# Altium project Pathfinder_pcb.PrjPcb
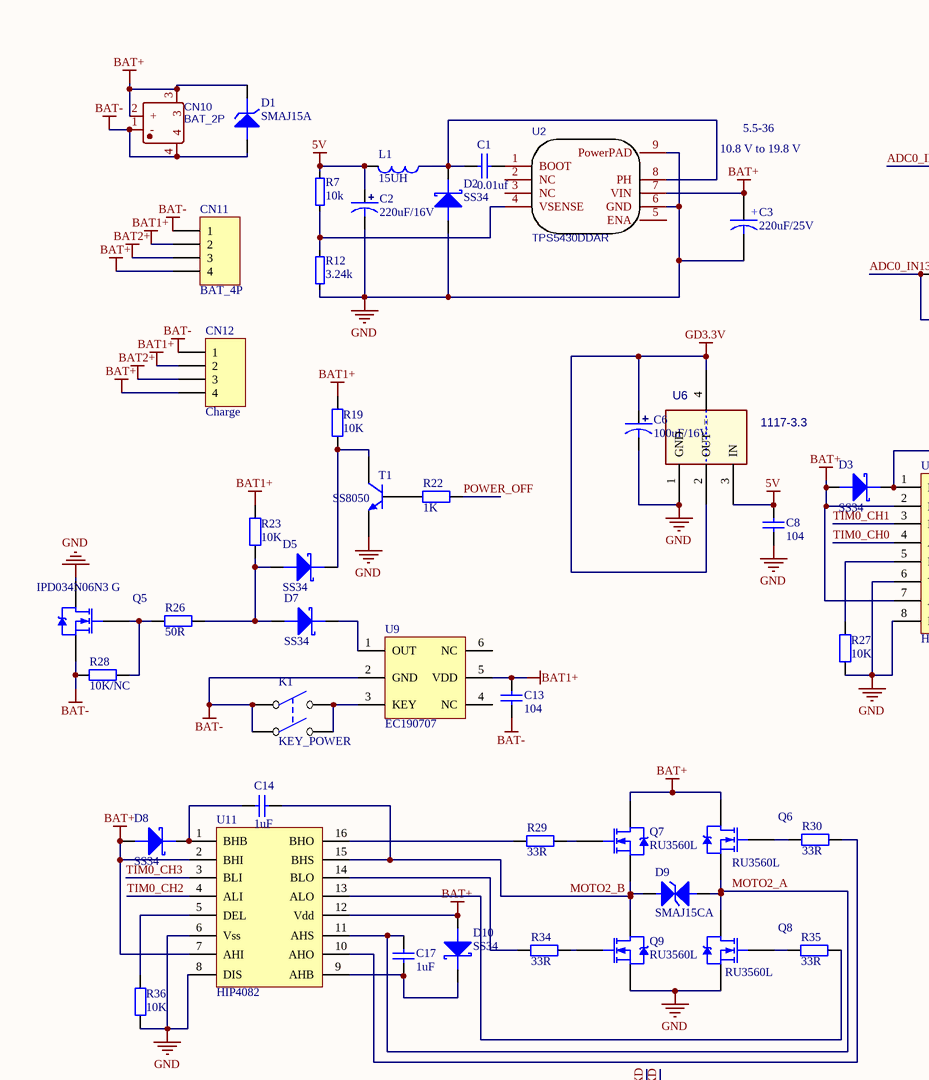
[diagram p0: pathfinder_sch.SchDoc, top left]
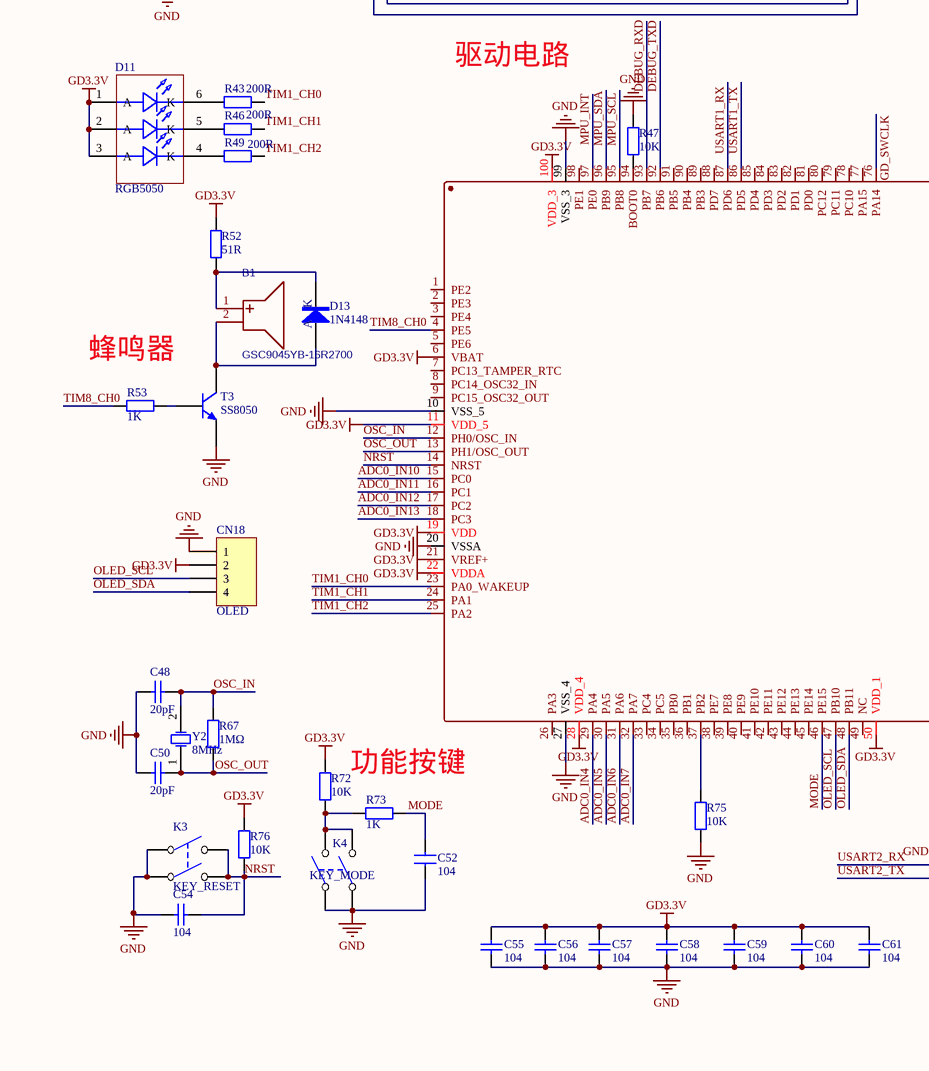
[diagram p1: pathfinder_sch.SchDoc, bottom left]
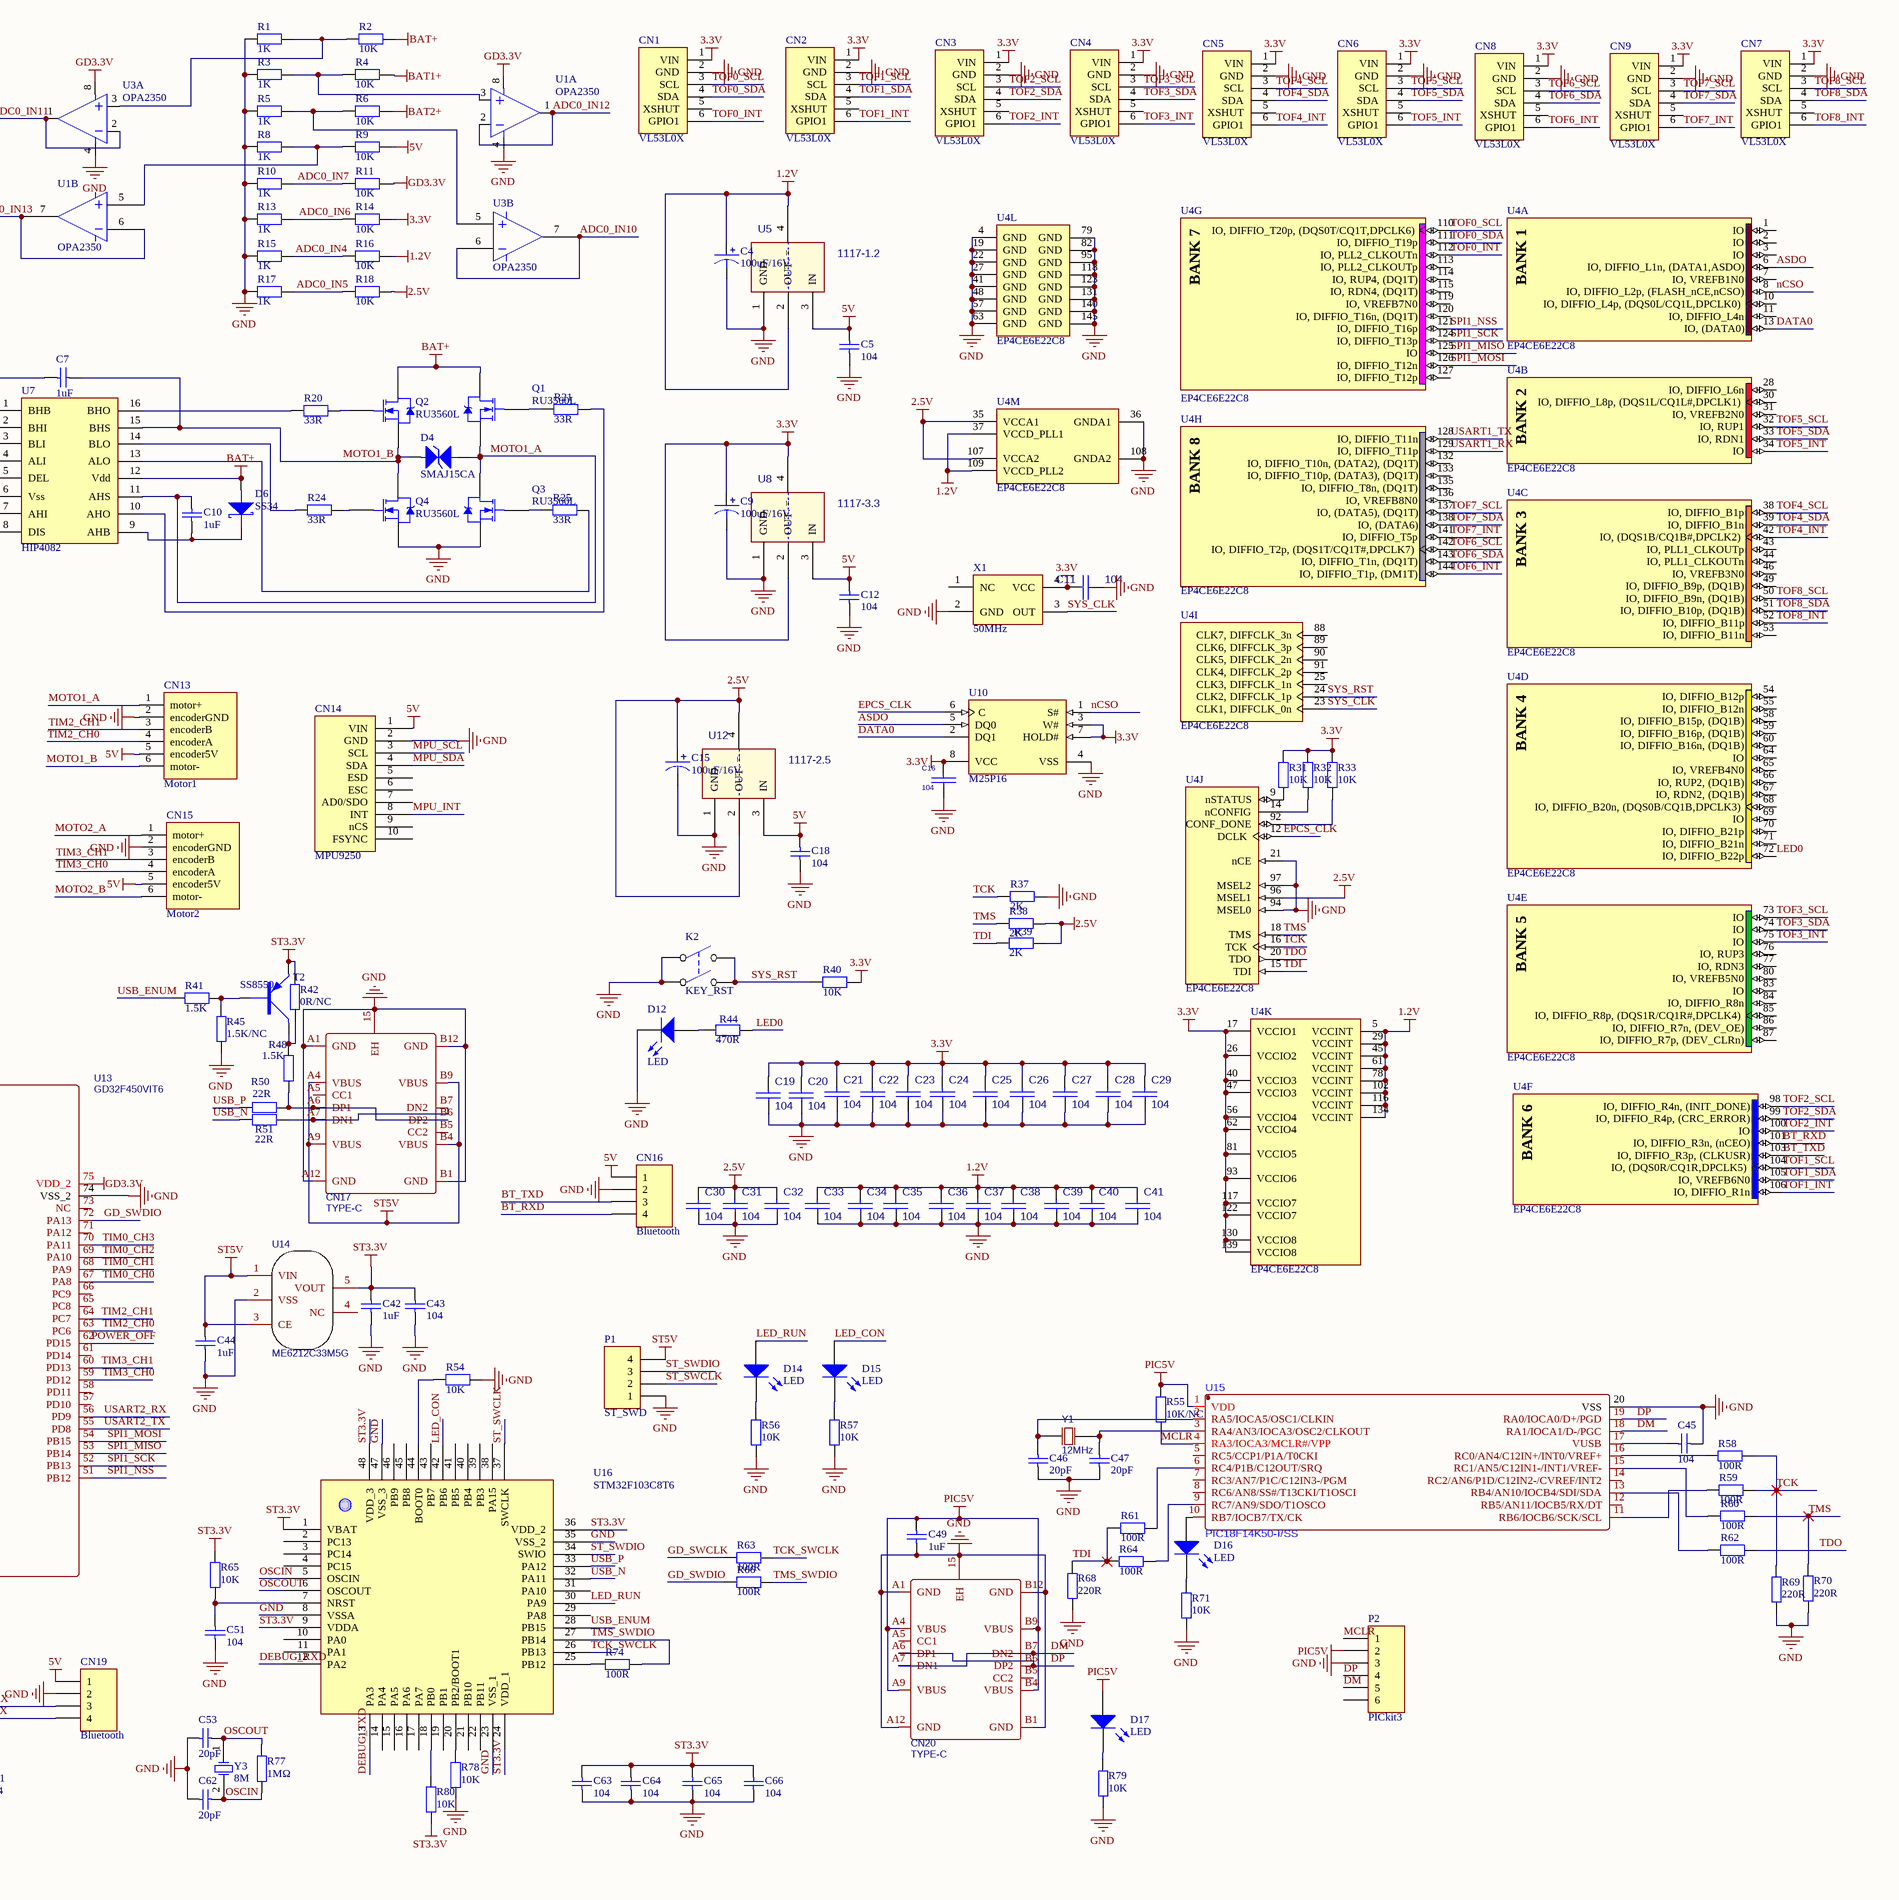
[diagram p2: pathfinder_sch.SchDoc, bottom right]
1 sheet, 223 parts. Net scope: global (net labels, ports and power ports of the same name join across sheets).
Board file: pathfinder_pcb.PcbDoc

## Sheet pathfinder_sch.SchDoc
size A2

### Parts
B1  GSC9045YB-16R2700  [BUZ-SMD_GSC9045YB-16R2700]
C1  0.01uf  [0603-JLC]
C2  220uF/16V  [SMD,6.3x5.3mm]
C3  220uF/25V  [SMD,6.3x5.8mm]
C4  100uF/16V  [SMD,6.3x5.3mm]
C5  104  [0603-JLC]
C6  100uF/16V  [SMD,6.3x5.3mm]
C7  1uF  [0603-JLC]
C8  104  [0603-JLC]
C9  100uF/16V  [SMD,6.3x5.3mm]
C10  1uF  [0603-JLC]
C11  104  [0603-JLC]
C12  104  [0603-JLC]
C13  104  [0603-JLC]
C14  1uF  [0603-JLC]
C15  100uF/16V  [SMD,6.3x5.3mm]
C16  104  [0603-JLC]
C17  1uF  [0603-JLC]
C18  104  [0603-JLC]
C19  104  [0603-JLC]
C20  104  [0603-JLC]
C21  104  [0603-JLC]
C22  104  [0603-JLC]
C23  104  [0603-JLC]
C24  104  [0603-JLC]
C25  104  [0603-JLC]
C26  104  [0603-JLC]
C27  104  [0603-JLC]
C28  104  [0603-JLC]
C29  104  [0603-JLC]
C30  104  [0603-JLC]
C31  104  [0603-JLC]
C32  104  [0603-JLC]
C33  104  [0603-JLC]
C34  104  [0603-JLC]
C35  104  [0603-JLC]
C36  104  [0603-JLC]
C37  104  [0603-JLC]
C38  104  [0603-JLC]
C39  104  [0603-JLC]
C40  104  [0603-JLC]
C41  104  [0603-JLC]
C42  1uF  [0603-JLC]
C43  104  [0603-JLC]
C44  1uF  [0603-JLC]
C45  104  [0603-JLC]
C46  20pF  [0603-JLC]
C47  20pF  [0603-JLC]
C48  20pF  [0603-JLC]
C49  1uF  [0603-JLC]
C50  20pF  [0603-JLC]
C51  104  [0603-JLC]
C52  104  [0603-JLC]
C53  20pF  [0603-JLC]
C54  104  [0603-JLC]
C55  104  [0603-JLC]
C56  104  [0603-JLC]
C57  104  [0603-JLC]
C58  104  [0603-JLC]
C59  104  [0603-JLC]
C60  104  [0603-JLC]
C61  104  [0603-JLC]
C62  20pF  [0603-JLC]
C63  104  [0603-JLC]
C64  104  [0603-JLC]
C65  104  [0603-JLC]
C66  104  [0603-JLC]
CN1  VL53L0X  [HDR1X6]
CN2  VL53L0X  [HDR1X6]
CN3  VL53L0X  [HDR1X6]
CN4  VL53L0X  [HDR1X6]
CN5  VL53L0X  [HDR1X6]
CN6  VL53L0X  [HDR1X6]
CN7  VL53L0X  [HDR1X6]
CN8  VL53L0X  [HDR1X6]
CN9  VL53L0X  [HDR1X6]
CN10  BAT_2P  [CONN-TH_XT60PW-M]
CN11  BAT_4P  [CONN-TH_4P-P2.54_X8821WR-06S-N2SN]
CN12  Charge  [CONN-TH_4P-P2.54_X8821WR-06S-N2SN]
CN13  Motor1  [CONN-TH_6P-P2.50_X8821WR-06S-N2SN]
CN14  MPU9250  [HDR1X10]
CN15  Motor2  [CONN-TH_6P-P2.50_X8821WR-06S-N2SN]
CN16  Bluetooth  [HDR1X4]
CN17  TYPE-C  [TYPE-C-SMD_918-468K2029Y50001]
CN18  OLED  [HDR1X4]
CN19  Bluetooth  [HDR1X4]
CN20  TYPE-C  [TYPE-C-SMD_918-468K2029Y50001]
D1  SMAJ15A  [SMA(DO-214AC)]
D2  SS34  [SMA(DO-214AC)]
D3  SS34  [SMA(DO-214AC)]
D4  SMAJ15CA  [SMA(DO-214AC)]
D5  SS34  [SMA(DO-214AC)]
D6  SS34  [SMA(DO-214AC)]
D7  SS34  [SMA(DO-214AC)]
D8  SS34  [SMA(DO-214AC)]
D9  SMAJ15CA  [SMA(DO-214AC)]
D10  SS34  [SMA(DO-214AC)]
D11  RGB5050  [LED-SMD_6P-L5.0-W5.0-FD]
D12  LED  [0603LED]
D13  1N4148  [1206]
D14  LED  [0603LED]
D15  LED  [0603LED]
D16  LED  [0603LED]
D17  LED  [0603LED]
K1  KEY_POWER  [SW-6/6]
K2  KEY_RST  [SW-6/6]
K3  KEY_RESET  [SW-6/6]
K4  KEY_MODE  [SW-6/6]
L1  15UH  [IND-SMD_L7.1-W6.6]
P1  ST_SWD  [HDR1X4]
P2  PICkit3  [HDR1X6]
Q1  RU3560L  [TO-252-3L]
Q2  RU3560L  [TO-252-3L]
Q3  RU3560L  [TO-252-3L]
Q4  RU3560L  [TO-252-3L]
Q5  IPD034N06N3 G  [TO-252-3_L6.5-W5.8-P4.58-TL]
Q6  RU3560L  [TO-252-3L]
Q7  RU3560L  [TO-252-3L]
Q8  RU3560L  [TO-252-3L]
Q9  RU3560L  [TO-252-3L]
R1  1K  [0603-JLC]
R2  10K  [0603-JLC]
R3  1K  [0603-JLC]
R4  10K  [0603-JLC]
R5  1K  [0603-JLC]
R6  10K  [0603-JLC]
R7  10k  [0603-JLC]
R8  1K  [0603-JLC]
R9  10K  [0603-JLC]
R10  1K  [0603-JLC]
R11  10K  [0603-JLC]
R12  3.24k  [0603-JLC]
R13  1K  [0603-JLC]
R14  10K  [0603-JLC]
R15  1K  [0603-JLC]
R16  10K  [0603-JLC]
R17  1K  [0603-JLC]
R18  10K  [0603-JLC]
R19  10K  [0603-JLC]
R20  33R  [0603-JLC]
R21  33R  [0603-JLC]
R22  1K  [0603-JLC]
R23  10K  [0603-JLC]
R24  33R  [0603-JLC]
R25  33R  [0603-JLC]
R26  50R  [0603-JLC]
R27  10K  [0603-JLC]
R28  10K/NC  [0603-JLC]
R29  33R  [0603-JLC]
R30  33R  [0603-JLC]
R31  10K  [0603-JLC]
R32  10K  [0603-JLC]
R33  10K  [0603-JLC]
R34  33R  [0603-JLC]
R35  33R  [0603-JLC]
R36  10K  [0603-JLC]
R37  2K  [0603-JLC]
R38  2K  [0603-JLC]
R39  2K  [0603-JLC]
R40  10K  [0603-JLC]
R41  1.5K  [0603-JLC]
R42  0R/NC  [0603-JLC]
R43  200R  [0603-JLC]
R44  470R  [0603-JLC]
R45  1.5K/NC  [0603-JLC]
R46  200R  [0603-JLC]
R47  10K  [0603-JLC]
R48  1.5K  [0603-JLC]
R49  200R  [0603-JLC]
R50  22R  [0603-JLC]
R51  22R  [0603-JLC]
R52  51R  [0603-JLC]
R53  1K  [0603-JLC]
R54  10K  [0603-JLC]
R55  10K/NC  [0603-JLC]
R56  10K  [0603-JLC]
R57  10K  [0603-JLC]
R58  100R  [0603-JLC]
R59  100R  [0603-JLC]
R60  100R  [0603-JLC]
R61  100R  [0603-JLC]
R62  100R  [0603-JLC]
R63  100R  [0603-JLC]
R64  100R  [0603-JLC]
R65  10K  [0603-JLC]
R66  100R  [0603-JLC]
R67  1MΩ  [0603-JLC]
R68  220R  [0603-JLC]
R69  220R  [0603-JLC]
R70  220R  [0603-JLC]
R71  10K  [0603-JLC]
R72  10K  [0603-JLC]
R73  1K  [0603-JLC]
R74  100R  [0603-JLC]
R75  10K  [0603-JLC]
R76  10K  [0603-JLC]
R77  1MΩ  [0603-JLC]
R78  10K  [0603-JLC]
R79  10K  [0603-JLC]
R80  10K  [0603-JLC]
T1  SS8050  [SOT-23]
T2  SS8550  [SOT-23]
T3  SS8050  [SOT-23]
U1  OPA2350  [SOP_8]  (parts A,B of 2)
U2  TPS5430DDAR  [SOIC-8_L5.0-W4.0-P1.27-LS6.0-BL-EP2.0]
U3  OPA2350  [SOP_8]  (parts A,B of 2)
U4  EP4CE6E22C8  [EQFP144_L]  (parts A,B,C,D,E,F,G,H,I,J,K,L,M of 13)
U5  1117-1.2  [SOT223]
U6  1117-3.3  [SOT223]
U7  HIP4082  [HIP4082b]
U8  1117-3.3  [SOT223]
U9  EC190707  [SOT-23-6_L2.9-W1.6-P0.95-LS2.8-BL]
U10  M25P16  [SOIC-8_150mil]
U11  HIP4082  [HIP4082b]
U12  1117-2.5  [SOT223]
U13  GD32F450VIT6  [LQFP-100_L14.0-W14.0-P0.50-LS16.0-BL]
U14  ME6212C33M5G  [ME6212C33M5G]
U15  PIC18F14K50-I/SS  [SSOP-20_L7.2-W5.3-P0.65-LS7.8-BL]
U16  STM32F103C8T6  [STM32F103C6T6]
X1  50MHz  [SMD-7050_4P]
Y1  12MHz  [HC-49S_L11.4-W4.8]
Y2  8MHz  [3225]
Y3  8M  [3225]

### Nets
1.2V: C4.1 C33.1 C34.1 C35.1 C36.1 C37.1 C38.1 C39.1 C40.1 C41.1 R16.2 U4.5(VCCINT) U4.29(VCCINT) U4.37(VCCD_PLL1) U4.45(VCCINT) U4.61(VCCINT) U4.78(VCCINT) U4.102(VCCINT) U4.109(VCCD_PLL2) U4.116(VCCINT) U4.134(VCCINT) U5.2(OUT) U5.4(=)
2.5V: C15.1 C30.1 C31.1 C32.1 R18.2 R38.1 R39.1 U4.35(VCCA1) U4.96(MSEL1) U4.107(VCCA2) U12.2(OUT) U12.4(=)
3.3V: C9.1 C11.1 C16.1 C19.1 C20.1 C21.1 C22.1 C23.1 C24.1 C25.1 C26.1 C27.1 C28.1 C29.1 CN1.1(VIN) CN2.1(VIN) CN3.1(VIN) CN4.1(VIN) CN5.1(VIN) CN6.1(VIN) CN7.1(VIN) CN8.1(VIN) CN9.1(VIN) R14.2 R31.2 R32.2 R33.2 R40.1 U4.17(VCCIO1) U4.26(VCCIO2) U4.40(VCCIO3) U4.47(VCCIO3) U4.56(VCCIO4) U4.62(VCCIO4) U4.81(VCCIO5) U4.93(VCCIO6) U4.117(VCCIO7) U4.122(VCCIO7) U4.130(VCCIO8) U4.139(VCCIO8) U8.2(OUT) U8.4(=) U10.3(W#) U10.7(HOLD#) U10.8(VCC) X1.4(VCC)
5V: C2.1 C5.2 C8.2 C12.2 C18.2 CN13.5(encoder5V) CN14.1(VIN) CN15.5(encoder5V) CN16.1 CN19.1 L1.1 R7.2 R9.2 U5.3(IN) U6.3(IN) U8.3(IN) U12.3(IN)
BAT1+: C13.2 CN11.2 CN12.2 R4.2 R19.1 R23.2 U9.5(VDD)
BAT2+: CN11.3 CN12.3 R6.2
BAT+: C3.1 CN10.2(+) CN10.3 CN11.4 CN12.4 D1.1(K) D3.2(A) D6.2(A) D8.2(A) D10.2(A) Q1.2(D) Q2.2(D) Q6.2(D) Q7.2(D) R2.2 U2.7(VIN) U7.2(BHI) U7.7(AHI) U7.12(Vdd) U11.2(BHI) U11.7(AHI) U11.12(Vdd)
BAT-: C13.1 CN10.1(-) CN10.4 CN11.1 CN12.1 D1.2(A) K1.1(COMMON1) Q5.3(S) R28.2 U9.2(GND)
GD3.3V: C6.1 C55.2 C56.2 C57.2 C58.2 C59.2 C60.2 C61.2 CN18.2 D11.1(A) D11.2(A) D11.3(A) R11.2 R52.1 R72.2 R76.2 U1.8 U3.8 U6.2(OUT) U6.4(=) U13.6(VBAT) U13.11(VDD_5) U13.19(VDD) U13.21(VREF+) U13.22(VDDA) U13.28(VDD_4) U13.50(VDD_1) U13.75(VDD_2) U13.100(VDD_3)
GND: C2.2 C3.2 C4.2 C5.1 C6.2 C8.1 C9.2 C11.2 C12.1 C15.2 C16.2 C18.1 C19.2 C20.2 C21.2 C22.2 C23.2 C24.2 C25.2 C26.2 C27.2 C28.2 C29.2 C30.2 C31.2 C32.2 C33.2 C34.2 C35.2 C36.2 C37.2 C38.2 C39.2 C40.2 C41.2 C42.1 C43.1 C44.1 C45.1 C46.1 C47.1 C48.1 C49.1 C50.1 C51.2 C52.2 C53.1 C54.1 C55.1 C56.1 C57.1 C58.1 C59.1 C60.1 C61.1 C62.1 C63.1 C64.1 C65.1 C66.1 CN1.2(GND) CN2.2(GND) CN3.2(GND) CN4.2(GND) CN5.2(GND) CN6.2(GND) CN7.2(GND) CN8.2(GND) CN9.2(GND) CN13.2(encoderGND) CN14.2(GND) CN15.2(encoderGND) CN16.2 CN17.15(EH) CN17.A1(GND) CN17.A12(GND) CN17.B1(GND) CN17.B12(GND) CN18.1 CN19.2 CN20.15(EH) CN20.A1(GND) CN20.A12(GND) CN20.B1(GND) CN20.B12(GND) D2.2(A) D12.2(K) K2.1(COMMON1) K3.1(COMMON1) K4.1(COMMON1) P1.1 P2.3 Q3.3(S) Q4.3(S) Q5.2(D) Q8.3(S) Q9.3(S) R1.1 R3.1 R5.1 R8.1 R10.1 R12.1 R13.1 R15.1 R17.1 R27.1 R36.1 R37.1 R45.2 R47.1 R54.2 R56.1 R57.1 R68.1 R69.1 R70.1 R71.1 R75.2 R78.1 R79.1 T1.2(E) T3.2(E) U1.4 U2.6(GND) U2.9(PowerPAD) U3.4 U4.4(GND) U4.19(GND) U4.21(nCE) U4.22(GND) U4.27(GND) U4.36(GNDA1) U4.41(GND) U4.48(GND) U4.57(GND) U4.63(GND) U4.79(GND) U4.82(GND) U4.94(MSEL0) U4.95(GND) U4.97(MSEL2) U4.108(GNDA2) U4.118(GND) U4.123(GND) U4.131(GND) U4.140(GND) U4.145(GND) U5.1(GND) U6.1(GND) U7.6(Vss) U7.8(DIS) U8.1(GND) U10.4(VSS) U11.6(Vss) U11.8(DIS) U12.1(GND) U13.10(VSS_5) U13.20(VSSA) U13.27(VSS_4) U13.74(VSS_2) U13.99(VSS_3) U14.2(VSS) U15.20(VSS) U16.8(VSSA) U16.23(VSS_1) U16.35(VSS_2) U16.47(VSS_3) X1.2(GND)
PIC5V: C49.2 CN20.A4(VBUS) CN20.A9(VBUS) CN20.B4(VBUS) CN20.B9(VBUS) D17.1(A) P2.2 R55.2 U15.1(VDD)
ST3.3V: C42.2 C43.2 C63.2 C64.2 C65.2 C66.2 R42.1 R65.2 R80.1 T2.2(E) U14.5(VOUT) U16.1(VBAT) U16.9(VDDA) U16.24(VDD_1) U16.36(VDD_2) U16.48(VDD_3)
ST5V: C44.2 CN17.A4(VBUS) CN17.A9(VBUS) CN17.B4(VBUS) CN17.B9(VBUS) P1.4 U14.1(VIN) U14.3(CE)
ADC0_IN4: R15.2 R16.1 U13.29(PA4)
ADC0_IN5: R17.2 R18.1 U13.30(PA5)
ADC0_IN6: R13.2 R14.1 U13.31(PA6)
ADC0_IN7: R10.2 R11.1 U13.32(PA7)
ADC0_IN10: U3.6 U3.7 U13.15(PC0)
ADC0_IN11: U3.1 U3.2 U13.16(PC1)
ADC0_IN12: U1.1 U1.2 U13.17(PC2)
ADC0_IN13: U1.6 U1.7 U13.18(PC3)
ASDO: U4.6(IO,_DIFFIO_L1n,_(DATA1,ASDO)) U10.5(DQ0)
BT_RXD: CN16.4 U4.101(IO,_DIFFIO_R3n,_(nCEO))
BT_TXD: CN16.3 U4.103(IO,_DIFFIO_R3p,_(CLKUSR))
DATA0: U4.13(IO,_(DATA0)) U10.2(DQ1)
DEBUG_RXD: U13.93(PB7) U16.12(PA2)
DEBUG_TXD: U13.92(PB6) U16.13(PA3)
DM: CN20.A7(DN1) CN20.B7(DN2) P2.5 U15.18(RA1/IOCA1/D-/PGC)
DP: CN20.A6(DP1) CN20.B6(DP2) P2.4 U15.19(RA0/IOCA0/D+/PGD)
EPCS_CLK: U4.12(DCLK) U10.6(C)
GD_SWCLK: R63.1 U13.76(PA14)
GD_SWDIO: R66.1 U13.72(PA13)
LED0: R44.1 U4.72(IO,_DIFFIO_B22p)
LED_CON: D15.1(A) U16.42(PB6)
LED_RUN: D14.1(A) U16.30(PA9)
MCLR: P2.1 R55.1 U15.4(RA3/IOCA3/MCLR#/VPP)
MODE: C52.1 R73.1 U13.46(PE15)
MOTO1_A: C10.2 CN13.1(motor+) D4.2(K) Q1.3(S) Q3.2(D) U7.11(AHS)
MOTO1_B: C7.2 CN13.6(motor-) D4.1(A) Q2.3(S) Q4.2(D) U7.15(BHS)
MOTO2_A: C17.2 CN15.1(motor+) D9.2(K) Q6.3(S) Q8.2(D) U11.11(AHS)
MOTO2_B: C14.2 CN15.6(motor-) D9.1(A) Q7.3(S) Q9.2(D) U11.15(BHS)
MPU_INT: CN14.8(INT) U13.97(PE0)
MPU_SCL: CN14.3(SCL) U13.95(PB8)
MPU_SDA: CN14.4(SDA) U13.96(PB9)
nCSO: U4.8(IO,_DIFFIO_L2p,_(FLASH_nCE,nCSO)) U10.1(S#)
NRST: C54.2 K3.2(NO1) R76.1 U13.14(NRST)
OLED_SCL: CN18.3 U13.47(PB10)
OLED_SDA: CN18.4 U13.48(PB11)
OSC_IN: C48.2 R67.2 U13.12(PH0/OSC_IN) Y2.2(OSC2)
OSC_OUT: C50.2 R67.1 U13.13(PH1/OSC_OUT) Y2.1(OSC1)
OSCIN: C62.2 R77.1 U16.5(OSCIN) Y3.2
OSCOUT: C53.2 R77.2 U16.6(OSCOUT) Y3.1
POWER_OFF: R22.1 U13.62(PD15)
SPI1_MISO: U4.125(IO) U13.53(PB14)
SPI1_MOSI: U4.126(IO,_DIFFIO_T12n) U13.54(PB15)
SPI1_NSS: U4.121(IO,_DIFFIO_T16p) U13.51(PB12)
SPI1_SCK: U4.124(IO,_DIFFIO_T13p) U13.52(PB13)
ST_SWCLK: P1.2 U16.37(SWCLK)
ST_SWDIO: P1.3 U16.34(SWIO)
SYS_CLK: U4.23(CLK1,_DIFFCLK_0n) X1.3(OUT)
SYS_RST: K2.2(NO1) R40.2 U4.24(CLK2,_DIFFCLK_1p)
TCK: R37.2 R58.1 R59.1 R69.2 U4.16(TCK)
TCK_SWCLK: R63.2 U16.26(PB13)
TDI: R39.2 R61.2 R64.2 R68.2 U4.15(TDI)
TDO: R62.1 U4.20(TDO)
TIM0_CH0: U7.4(ALI) U13.67(PA8)
TIM0_CH1: U7.3(BLI) U13.68(PA9)
TIM0_CH2: U11.4(ALI) U13.69(PA10)
TIM0_CH3: U11.3(BLI) U13.70(PA11)
TIM1_CH0: R43.1 U13.23(PA0_WAKEUP)
TIM1_CH1: R46.1 U13.24(PA1)
TIM1_CH2: R49.1 U13.25(PA2)
TIM2_CH0: CN13.4(encoderA) U13.63(PC6)
TIM2_CH1: CN13.3(encoderB) U13.64(PC7)
TIM3_CH0: CN15.4(encoderA) U13.59(PD12)
TIM3_CH1: CN15.3(encoderB) U13.60(PD13)
TIM8_CH0: R53.1 U13.4(PE5)
TMS: R38.2 R60.1 R70.2 U4.18(TMS)
TMS_SWDIO: R66.2 R74.2 U16.27(PB14)
TOF0_INT: CN1.6(GPIO1) U4.112(IO,_PLL2_CLKOUTn)
TOF0_SCL: CN1.3(SCL) U4.110(IO,_DIFFIO_T20p,_(DQS0T/CQ1T,DPCLK6))
TOF0_SDA: CN1.4(SDA) U4.111(IO,_DIFFIO_T19p)
TOF1_INT: CN2.6(GPIO1) U4.106(IO,_DIFFIO_R1n)
TOF1_SCL: CN2.3(SCL) U4.104(IO,_(DQS0R/CQ1R,DPCLK5))
TOF1_SDA: CN2.4(SDA) U4.105(IO,_VREFB6N0)
TOF2_INT: CN3.6(GPIO1) U4.100(IO)
TOF2_SCL: CN3.3(SCL) U4.98(IO,_DIFFIO_R4n,_(INIT_DONE))
TOF2_SDA: CN3.4(SDA) U4.99(IO,_DIFFIO_R4p,_(CRC_ERROR))
TOF3_INT: CN4.6(GPIO1) U4.75(IO)
TOF3_SCL: CN4.3(SCL) U4.73(IO)
TOF3_SDA: CN4.4(SDA) U4.74(IO)
TOF4_INT: CN5.6(GPIO1) U4.42(IO,_(DQS1B/CQ1B#,DPCLK2))
TOF4_SCL: CN5.3(SCL) U4.38(IO,_DIFFIO_B1p)
TOF4_SDA: CN5.4(SDA) U4.39(IO,_DIFFIO_B1n)
TOF5_INT: CN6.6(GPIO1) U4.34(IO)
TOF5_SCL: CN6.3(SCL) U4.32(IO,_RUP1)
TOF5_SDA: CN6.4(SDA) U4.33(IO,_RDN1)
TOF6_INT: CN8.6(GPIO1) U4.144(IO,_DIFFIO_T1p,_(DM1T))
TOF6_SCL: CN8.3(SCL) U4.142(IO,_DIFFIO_T2p,_(DQS1T/CQ1T#,DPCLK7))
TOF6_SDA: CN8.4(SDA) U4.143(IO,_DIFFIO_T1n,_(DQ1T))
TOF7_INT: CN9.6(GPIO1) U4.141(IO,_DIFFIO_T5p)
TOF7_SCL: CN9.3(SCL) U4.137(IO,_(DATA5),_(DQ1T))
TOF7_SDA: CN9.4(SDA) U4.138(IO,_(DATA6))
TOF8_INT: CN7.6(GPIO1) U4.52(IO,_DIFFIO_B11p)
TOF8_SCL: CN7.3(SCL) U4.50(IO,_DIFFIO_B9n,_(DQ1B))
TOF8_SDA: CN7.4(SDA) U4.51(IO,_DIFFIO_B10p,_(DQ1B))
USART1_RX: U4.129(IO,_DIFFIO_T11p) U13.87(PD6)
USART1_TX: U4.128(IO,_DIFFIO_T11n) U13.86(PD5)
USART2_RX: CN19.3 U13.56(PD9)
USART2_TX: CN19.4 U13.55(PD8)
USB_ENUM: R41.2 U16.28(PB15)
USB_N: R51.2 U16.32(PA11)
USB_P: R50.2 U16.33(PA12)
NetB1_1: B1.1(+) D13.2(K) R52.2
NetB1_2: B1.2(-) D13.1 T3.3(C)
NetC1_1: C1.1 D2.1(K) L1.2 U2.8(PH)
NetC1_2: C1.2 U2.1(BOOT)
NetC7_1: C7.1 D3.1(K) U7.1(BHB)
NetC10_1: C10.1 D6.1(K) U7.9(AHB)
NetC14_1: C14.1 D8.1(K) U11.1(BHB)
NetC17_1: C17.1 D10.1(K) U11.9(AHB)
NetC45_2: C45.2 U15.17(VUSB)
NetC46_2: C46.2 U15.2(RA5/IOCA5/OSC1/CLKIN) Y1.1(OSC1)
NetC47_2: C47.2 U15.3(RA4/AN3/IOCA3/OSC2/CLKOUT) Y1.2(OSC2)
NetC51_1: C51.1 R65.1 U16.7(NRST)
NetCN17_A6: CN17.A6(DP1) CN17.B6(DP2) R48.2 R50.1
NetCN17_A7: CN17.A7(DN1) CN17.B7(DN2) R51.1
NetD5_1: D5.1(K) R19.2 T1.3(C)
NetD5_2: D5.2(A) D7.2(A) R23.1 R26.1
NetD7_1: D7.1(K) U9.1(OUT)
NetD11_4: D11.4(K) R49.2
NetD11_5: D11.5(K) R46.2
NetD11_6: D11.6(K) R43.2
NetD12_1: D12.1(A) R44.2
NetD14_2: D14.2(K) R56.2
NetD15_2: D15.2(K) R57.2
NetD16_1: D16.1(A) U15.10(RB7/IOCB7/TX/CK)
NetD16_2: D16.2(K) R71.2
NetD17_2: D17.2(K) R79.2
NetK1_2: K1.2(NO1) U9.3(KEY)
NetK4_2: K4.2(NO1) R72.1 R73.2
NetQ1_1: Q1.1(G) R21.2
NetQ2_1: Q2.1(G) R20.1
NetQ3_1: Q3.1(G) R25.2
NetQ4_1: Q4.1(G) R24.1
NetQ5_1: Q5.1(G) R26.2 R28.1
NetQ6_1: Q6.1(G) R30.2
NetQ7_1: Q7.1(G) R29.1
NetQ8_1: Q8.1(G) R35.2
NetQ9_1: Q9.1(G) R34.1
NetR1_2: R1.2 R2.1 U3.3
NetR3_2: R3.2 R4.1 U1.3
NetR5_2: R5.2 R6.1 U3.5
NetR7_1: R7.1 R12.2 U2.4(VSENSE)
NetR8_2: R8.2 R9.1 U1.5
NetR20_2: R20.2 U7.16(BHO)
NetR21_1: R21.1 U7.10(AHO)
NetR22_2: R22.2 T1.1(B)
NetR24_2: R24.2 U7.14(BLO)
NetR25_1: R25.1 U7.13(ALO)
NetR27_2: R27.2 U7.5(DEL)
NetR29_2: R29.2 U11.16(BHO)
NetR30_1: R30.1 U11.10(AHO)
NetR31_1: R31.1 U4.9(nSTATUS)
NetR32_1: R32.1 U4.14(nCONFIG)
NetR33_1: R33.1 U4.92(CONF_DONE)
NetR34_2: R34.2 U11.14(BLO)
NetR35_1: R35.1 U11.13(ALO)
NetR36_2: R36.2 U11.5(DEL)
NetR41_1: R41.1 R45.1 T2.1(B)
NetR42_2: R42.2 R48.1 T2.3(C)
NetR47_2: R47.2 U13.94(BOOT0)
NetR53_2: R53.2 T3.1(B)
NetR54_1: R54.1 U16.44(BOOT0)
NetR58_2: R58.2 U15.16(RC0/AN4/C12IN+/INT0/VREF+)
NetR59_2: R59.2 U15.11(RB6/IOCB6/SCK/SCL)
NetR60_2: R60.2 U15.15(RC1/AN5/C12IN1-/INT1/VREF-)
NetR61_1: R61.1 U15.6(RC4/P1B/C12OUT/SRQ)
NetR62_2: R62.2 U15.13(RB4/AN10/IOCB4/SDI/SDA)
NetR64_1: R64.1 U15.9(RC7/AN9/SDO/T1OSCO)
NetR74_1: R74.1 U16.25(PB12)
NetR75_1: R75.1 U13.37(PB2)
NetR78_2: R78.2 U16.20(PB2/BOOT1)
NetR80_2: R80.2 U16.18(PB0)

Not connected (* = marked no-connect by the designer): CN1 5(XSHUT); CN2 5(XSHUT); CN3 5(XSHUT); CN4 5(XSHUT); CN5 5(XSHUT); CN6 5(XSHUT); CN7 5(XSHUT); CN8 5(XSHUT); CN9 5(XSHUT); CN14 5(ESD) 6(ESC) 7(AD0/SDO) 9(nCS) 10(FSYNC); CN17 A5(CC1) B5(CC2); CN20 A5(CC1) B5(CC2); P2 6; U2 2(NC) 3(NC) 5(ENA); U4 1(IO) 2(IO) 3(IO) 7(IO,_VREFB1N0) 10(IO,_DIFFIO_L4p,_(DQS0L/CQ1L,DPCLK0)) 11(IO,_DIFFIO_L4n) 25(CLK3,_DIFFCLK_1n) 28(IO,_DIFFIO_L6n) 30(IO,_DIFFIO_L8p,_(DQS1L/CQ1L#,DPCLK1)) 31(IO,_VREFB2N0) 43(IO,_PLL1_CLKOUTp) 44(IO,_PLL1_CLKOUTn) 46(IO,_VREFB3N0) 49(IO,_DIFFIO_B9p,_(DQ1B)) 53(IO,_DIFFIO_B11n) 54(IO,_DIFFIO_B12p) 55(IO,_DIFFIO_B12n) 58(IO,_DIFFIO_B15p,_(DQ1B)) 59(IO,_DIFFIO_B16p,_(DQ1B)) 60(IO,_DIFFIO_B16n,_(DQ1B)) 64(IO) 65(IO,_VREFB4N0) 66(IO,_RUP2,_(DQ1B)) 67(IO,_RDN2,_(DQ1B)) 68(IO,_DIFFIO_B20n,_(DQS0B/CQ1B,DPCLK3)) 69(IO) 70(IO,_DIFFIO_B21p) 71(IO,_DIFFIO_B21n) 76(IO,_RUP3) 77(IO,_RDN3) 80(IO,_VREFB5N0) 83(IO) 84(IO,_DIFFIO_R8n) 85(IO,_DIFFIO_R8p,_(DQS1R/CQ1R#,DPCLK4)) 86(IO,_DIFFIO_R7n,_(DEV_OE)) 87(IO,_DIFFIO_R7p,_(DEV_CLRn)) 88(CLK7,_DIFFCLK_3n) 89(CLK6,_DIFFCLK_3p) 90(CLK5,_DIFFCLK_2n) 91(CLK4,_DIFFCLK_2p) 113(IO,_PLL2_CLKOUTp) 114(IO,_RUP4,_(DQ1T)) 115(IO,_RDN4,_(DQ1T)) 119(IO,_VREFB7N0) 120(IO,_DIFFIO_T16n,_(DQ1T)) 127(IO,_DIFFIO_T12p) 132(IO,_DIFFIO_T10n,_(DATA2),_(DQ1T)) 133(IO,_DIFFIO_T10p,_(DATA3),_(DQ1T)) 135(IO,_DIFFIO_T8n,_(DQ1T)) 136(IO,_VREFB8N0); U9 4(NC) 6(NC); U13 1(PE2) 2(PE3) 3(PE4) 5(PE6) 7(PC13_TAMPER_RTC) 8(PC14_OSC32_IN) 9(PC15_OSC32_OUT) 26(PA3) 33(PC4) 34(PC5) 35(PB0) 36(PB1) 38(PE7) 39(PE8) 40(PE9) 41(PE10) 42(PE11) 43(PE12) 44(PE13) 45(PE14) 49(NC) 57(PD10) 58(PD11) 61(PD14) 65(PC8) 66(PC9) 71(PA12) 73(NC) 77(PA15) 78(PC10) 79(PC11) 80(PC12) 81(PD0) 82(PD1) 83(PD2) 84(PD3) 85(PD4) 88(PD7) 89(PB3) 90(PB4) 91(PB5) 98(PE1); U14 4(NC); U15 5(RC5/CCP1/P1A/T0CKI) 7(RC3/AN7/P1C/C12IN3-/PGM) 8(RC6/AN8/SS#/T13CKI/T1OSCI) 12(RB5/AN11/IOCB5/RX/DT) 14(RC2/AN6/P1D/C12IN2-/CVREF/INT2); U16 2(PC13) 3(PC14) 4(PC15) 10(PA0) 11(PA1) 14(PA4) 15(PA5) 16(PA6) 17(PA7) 19(PB1) 21(PB10) 22(PB11) 29(PA8) 31(PA10) 38(PA15) 39(PB3) 40(PB4) 41(PB5) 43(PB7) 45(PB8) 46(PB9); X1 1(NC)

### Notes on the sheet
- 10.8 V to 19.8 V
- 5.5-36
- 驱动电路
- (near R53) 蜂鸣器
- 功能按键
- Title
- Size:
- Date:
- File:
- A2
- Number:
- Time:
- Revision:
- Sheet
- of
- (in symbol CAP极性) +
- (in symbol DIODE) A
- (in symbol EP4CE6E22C8, part A) BANK 1
- (in symbol EP4CE6E22C8, part B) BANK 2
- (in symbol EP4CE6E22C8, part C) BANK 3
- (in symbol EP4CE6E22C8, part D) BANK 4
- (in symbol EP4CE6E22C8, part E) BANK 5
- (in symbol EP4CE6E22C8, part F) BANK 6
- (in symbol EP4CE6E22C8, part G) BANK 7
- (in symbol EP4CE6E22C8, part H) BANK 8

### Library data of the parts
B1 = GSC9045YB-16R2700: 无源蜂鸣器; BOM_Manufacturer: INGHAi; Contributor: LCSC; Frequency: 2700Hz; BOM_Supplier: LCSC; BOM_Supplier Part: C255324; BOM_Manufacturer Part: GSC9045YB-16R2700; BOM_JLCPCB Part Class: Extended Part; spicePre: B; spiceSymbolName: GSC9045YB-16R2700
C1 = 普通电容: C0603
C2 C4 C6 C9 C15 = SMD_ECAP: 6.3*5.3mm铝电解电容
C3 = CAP极性: 贴片铝电解电容SMD,6.3x5.8mm
C5 C8 C12 C13 C18 = Cap: C0603; Value: 0.1uf; Published: 8-Jun-2000; LatestRevisionDate: 17-Jul-2002; LatestRevisionNote: Re-released for DXP Platform.; PackageReference: RAD-0.3; Publisher: Altium Limited; PackageDescription: Radial Cap, Thru-Hole; 2 Leads; 0.3 in Pin Spacing
C7 C10 C14 C17 C42-C45 C48-C51 C54-C61 C63-C66 = Cap: C0603; Value: 100pF; Published: 8-Jun-2000; LatestRevisionDate: 17-Jul-2002; LatestRevisionNote: Re-released for DXP Platform.; PackageReference: RAD-0.3; Publisher: Altium Limited; PackageDescription: Radial Cap, Thru-Hole; 2 Leads; 0.3 in Pin Spacing
C11 = C_Dup3: C0603
C16 = C: C0603
C19-C41 = C_Dup4: C0603
C46 C47 C53 C62 = Cap: C0603; Value: 104; Published: 8-Jun-2000; LatestRevisionDate: 17-Jul-2002; LatestRevisionNote: Re-released for DXP Platform.; Publisher: Altium Limited
C52 = CAP: C0603
CN1-CN9 = VL53L0X: 弯针单排母座2.54mm 6P
CN10 = XT60PW-M: 板插卧式 XT60PW-M; BOM_Manufacturer: AMASS(艾迈斯); Contributor: LCSC; BOM_Supplier: LCSC; BOM_Supplier Part: C98732; BOM_Manufacturer Part: XT60PW-M; BOM_JLCPCB Part Class: Extended Part; spicePre: C; spiceSymbolName: XT60PW-M
CN11 CN12 = Header 4: 卧式XH2.54 4P; LatestRevisionDate: 17-Jul-2002; LatestRevisionNote: Re-released for DXP Platform.; Publisher: Altium Limited
CN13 CN15 = Motor: 卧式XH2.54 6P
CN14 = MPU6050: 直针单排母座 10P
CN16 CN18 CN19 = Header 4: 直针单排母座 4P; LatestRevisionDate: 17-Jul-2002; LatestRevisionNote: Re-released for DXP Platform.; Publisher: Altium Limited
CN17 CN20 = TYPE-C: 立式Type-C母座14pin; BOM_Manufacturer: 精拓金; BOM_Manufacturer Part: 918-468K2029Y50001; Contributor: LCSC; BOM_Supplier: LCSC; BOM_Supplier Part: C709023; BOM_JLCPCB Part Class: Extended Part; spicePre: U; spiceSymbolName: 918-468K2029Y50001
D1 = DIODE ZENER: 单向TVS管
D2 D3 D5-D8 D10 = DIODE SCHOTTKY: 肖特基二极管
D4 D9 = TVS: 双向TVS管
D11 = RGB5050: 5050灯珠
D12 D14-D17 = LED3: 0603白色LED; Published: 8-Jun-2000; LatestRevisionDate: 17-Dec-2003; LatestRevisionNote: PCB Footprint replaced.; DatasheetVersion: 16-Apr-2002; PackageVersion: 16-Apr-2002; PackageReference: 3.5X2.8X1.9; Publisher: Altium Limited; PackageDescription: SM LED; 2 C-Bend Leads; Body 3.5 x 2.8 x 1.9 mm, inc leads (LxWxH typ)
D13 = DIODE
K1-K4 = SW DPST: 贴片轻触开关
L1 = L: 一体成型功率电感
P1 = Header 4: Header, 4-Pin; LatestRevisionDate: 17-Jul-2002; LatestRevisionNote: Re-released for DXP Platform.; Publisher: Altium Limited
P2 = Header 6: Header, 6-Pin; LatestRevisionDate: 17-Jul-2002; LatestRevisionNote: Re-released for DXP Platform.; Publisher: Altium Limited
Q1-Q9 = IRFR1205: NMOSFET; Manufacturer: International Rectifier; Class I: Discrete; Class II: MOSFET - Power; Note: Pin 2 is trimmed and is electrically connected to Drain.; Published: 8-Jun-2000; Revision: July-2002: Re-released for DXP Platform.; Datasheet: Latest Revision: PD-91318B; Package Reference: TO-252AA; Publisher: Altium Limited
R1 R3 R5 R8 R10 R13 R15 R17 R22 R31-R33 R37-R42 R44 R45 R48 R50 R51 R53-R66 R68-R71 R73 R74 R77-R80 = Res2: R0603; Published: 8-Jun-2000; LatestRevisionDate: 17-Jul-2002; LatestRevisionNote: Re-released for DXP Platform.; Publisher: Altium Limited
  R1 R3 R5 R8 R10 R13 R15 R17 R22 R53 R73: PackageReference: AXIAL-0.4; PackageDescription: Axial Device, Thru-Hole; 2 Leads; 0.4 in Pin Spacing; Value: 1K
R2 R4 R6 R9 R11 R14 R16 R18-R21 R23-R30 R34-R36 R43 R46 R47 R49 R52 R67 R72 R75 R76 = Res2: R0603; Value: 1K; Published: 8-Jun-2000; LatestRevisionDate: 17-Jul-2002; LatestRevisionNote: Re-released for DXP Platform.; PackageReference: AXIAL-0.4; Publisher: Altium Limited; PackageDescription: Axial Device, Thru-Hole; 2 Leads; 0.4 in Pin Spacing
R7 R12 = RES: R0603
T1 T3 = 2N3904: NPN三极管
T2 = PNP: PNP三极管
U1 U3 = OPA2350: 两路运放芯片
U2 = TPS5430DDAR: DCDC降压芯片; BOM_Manufacturer: TI; BOM_Supplier: LCSC; BOM_Manufacturer Part: TPS5430DDAR; BOM_Supplier Part: C9864; BOM_JLCPCB Part Class: Basic Part; spicePre: U; spiceSymbolName: TPS5430DDAR
U4 = EP4CE6E22C8: FPGA; Published: 3-May-2010; DatasheetVersion: ver1.2, Mar-2010; PackageVersion: ver16.0, Dec-2009; PackageReference: EQFP144; Publisher: Altium Limited; PackageDescription: 144-Pin Plastic Enhanced Quad Flat Pack (EQFP144) - Wire Bond; Supplier 1: Digi-Key; Supplier Part Number 1: EP4CE6E22C8-ND; Code_JEDEC: MS-026-BFB; ComponentLink1Description: Manufacturer Link; ComponentLink1URL: http://www.altera.com/; ComponentLink2Description: Handbook; ComponentLink2URL: http://www.altera.com/literature/hb/cyclone-iv/cyclone4-handbook.pdf; ComponentLink3Description: Pinout Specification; ComponentLink3URL: http://www.altera.com/literature/lit-dp.jsp?category=cyc%204&showspreadsheet=y; ComponentLink4Description: Packaging Specification; ComponentLink4URL: http://www.altera.com/literature/ds/dspkg.pdf
U5 = 1117-3.3: 线性稳压1.2V
U6 U8 = 1117-3.3: 线性稳压3.3V
U7 U11 = HIP4082: H桥驱动芯片
U9 = EC190707: 电子开关芯片
U10 = M25P16-VMN3PB: FLASH存储芯片; Part Family: M25P爘ISHIDDEN=T; Manufacturer: Micron; Density: 16Mb爘ISHIDDEN=T; Speed: 75 MHz爘ISHIDDEN=T; Voltage: 2.7V-3.6V爘ISHIDDEN=T; DatasheetVersion: Rev. Y; PackageVersion: Rev 11; PackageReference: MICT-MN-8; PackageDescription: 8-Pin SO Narrow, 3.9 X 4.9 mm, Pitch 1.27 mm; Applications: Automotive爘ISHIDDEN=T; Package: SO8 Narrow爘ISHIDDEN=T; Part Status: Production爘ISHIDDEN=T; RoHS: Yes爘ISHIDDEN=T; Type: Data Storage爘ISHIDDEN=T; Width: x1爘ISHIDDEN=T; Mounting Technology: Surface Mount; PartNumber: M25P16-VMN3PB; ComponentLink1Description: Manufacturer URL; ComponentLink1URL: http://www.micron.com/; ComponentLink2Description: Datasheet; ComponentLink2URL: http://www.micron.com/~/media/Documents/Products/Data%20Sheet/NOR%20Flash/Serial%20NOR/M25P/M25P16.pdf; ComponentLink3Description: Package Specification; ComponentLink3URL: http://www.micron.com/~/media/Documents/Products/Data%20Sheet/NOR%20Flash/Serial%20NOR/M25P/M25P05A.pdf
U12 = 1117-3.3: 线性稳压2.5V
U13 = GD32F450VIT6: 单片机; BOM_Manufacturer: GigaDevice; BOM_Supplier: LCSC; BOM_Manufacturer Part: GD32F450VIT6; BOM_Supplier Part: C98441; BOM_JLCPCB Part Class: Extended Part; spicePre: U; spiceSymbolName: GD32F450VIT6
U14 = ME6212C33M5G: 线性稳压3.3V; BOM_Manufacturer: MICRONE; BOM_Supplier: LCSC; BOM_Manufacturer Part: ME6212C33M5G; BOM_Supplier Part: C81233; BOM_JLCPCB Part Class: Extended Part; spicePre: U; spiceSymbolName: ME6212C33M5G
U15 = PIC18F14K50-I/SS: 单片机
U16 = STM32F103C8T6: 单片机
X1 = 50MHZ有源晶振: 贴片有源晶振
Y1 = 12MHz: 贴片无源晶振; BOM_Manufacturer: Yangxing Tech; BOM_Manufacturer Part: X49SM12MSB2SI; nameAlias: Frequency; Contributor: LCSC; BOM_Supplier: LCSC; BOM_Supplier Part: C188206; BOM_JLCPCB Part Class: Extended Part; spicePre: X; spiceSymbolName: X49SM12MSB2SI
Y2 Y3 = XTAL: 贴片无源晶振; Published: 8-Jun-2000; LatestRevisionDate: 17-Jul-2002; LatestRevisionNote: Re-released for DXP Platform.; Publisher: Altium Limited
  Y2: PackageReference: R38; PackageDescription: Crystal, Thru-Hole; 2 Leads; Body 3.1 x 8.2 mm (Dia.xH)